# EAGLE schematic stm32f4_sd (EAGLE 6.3)
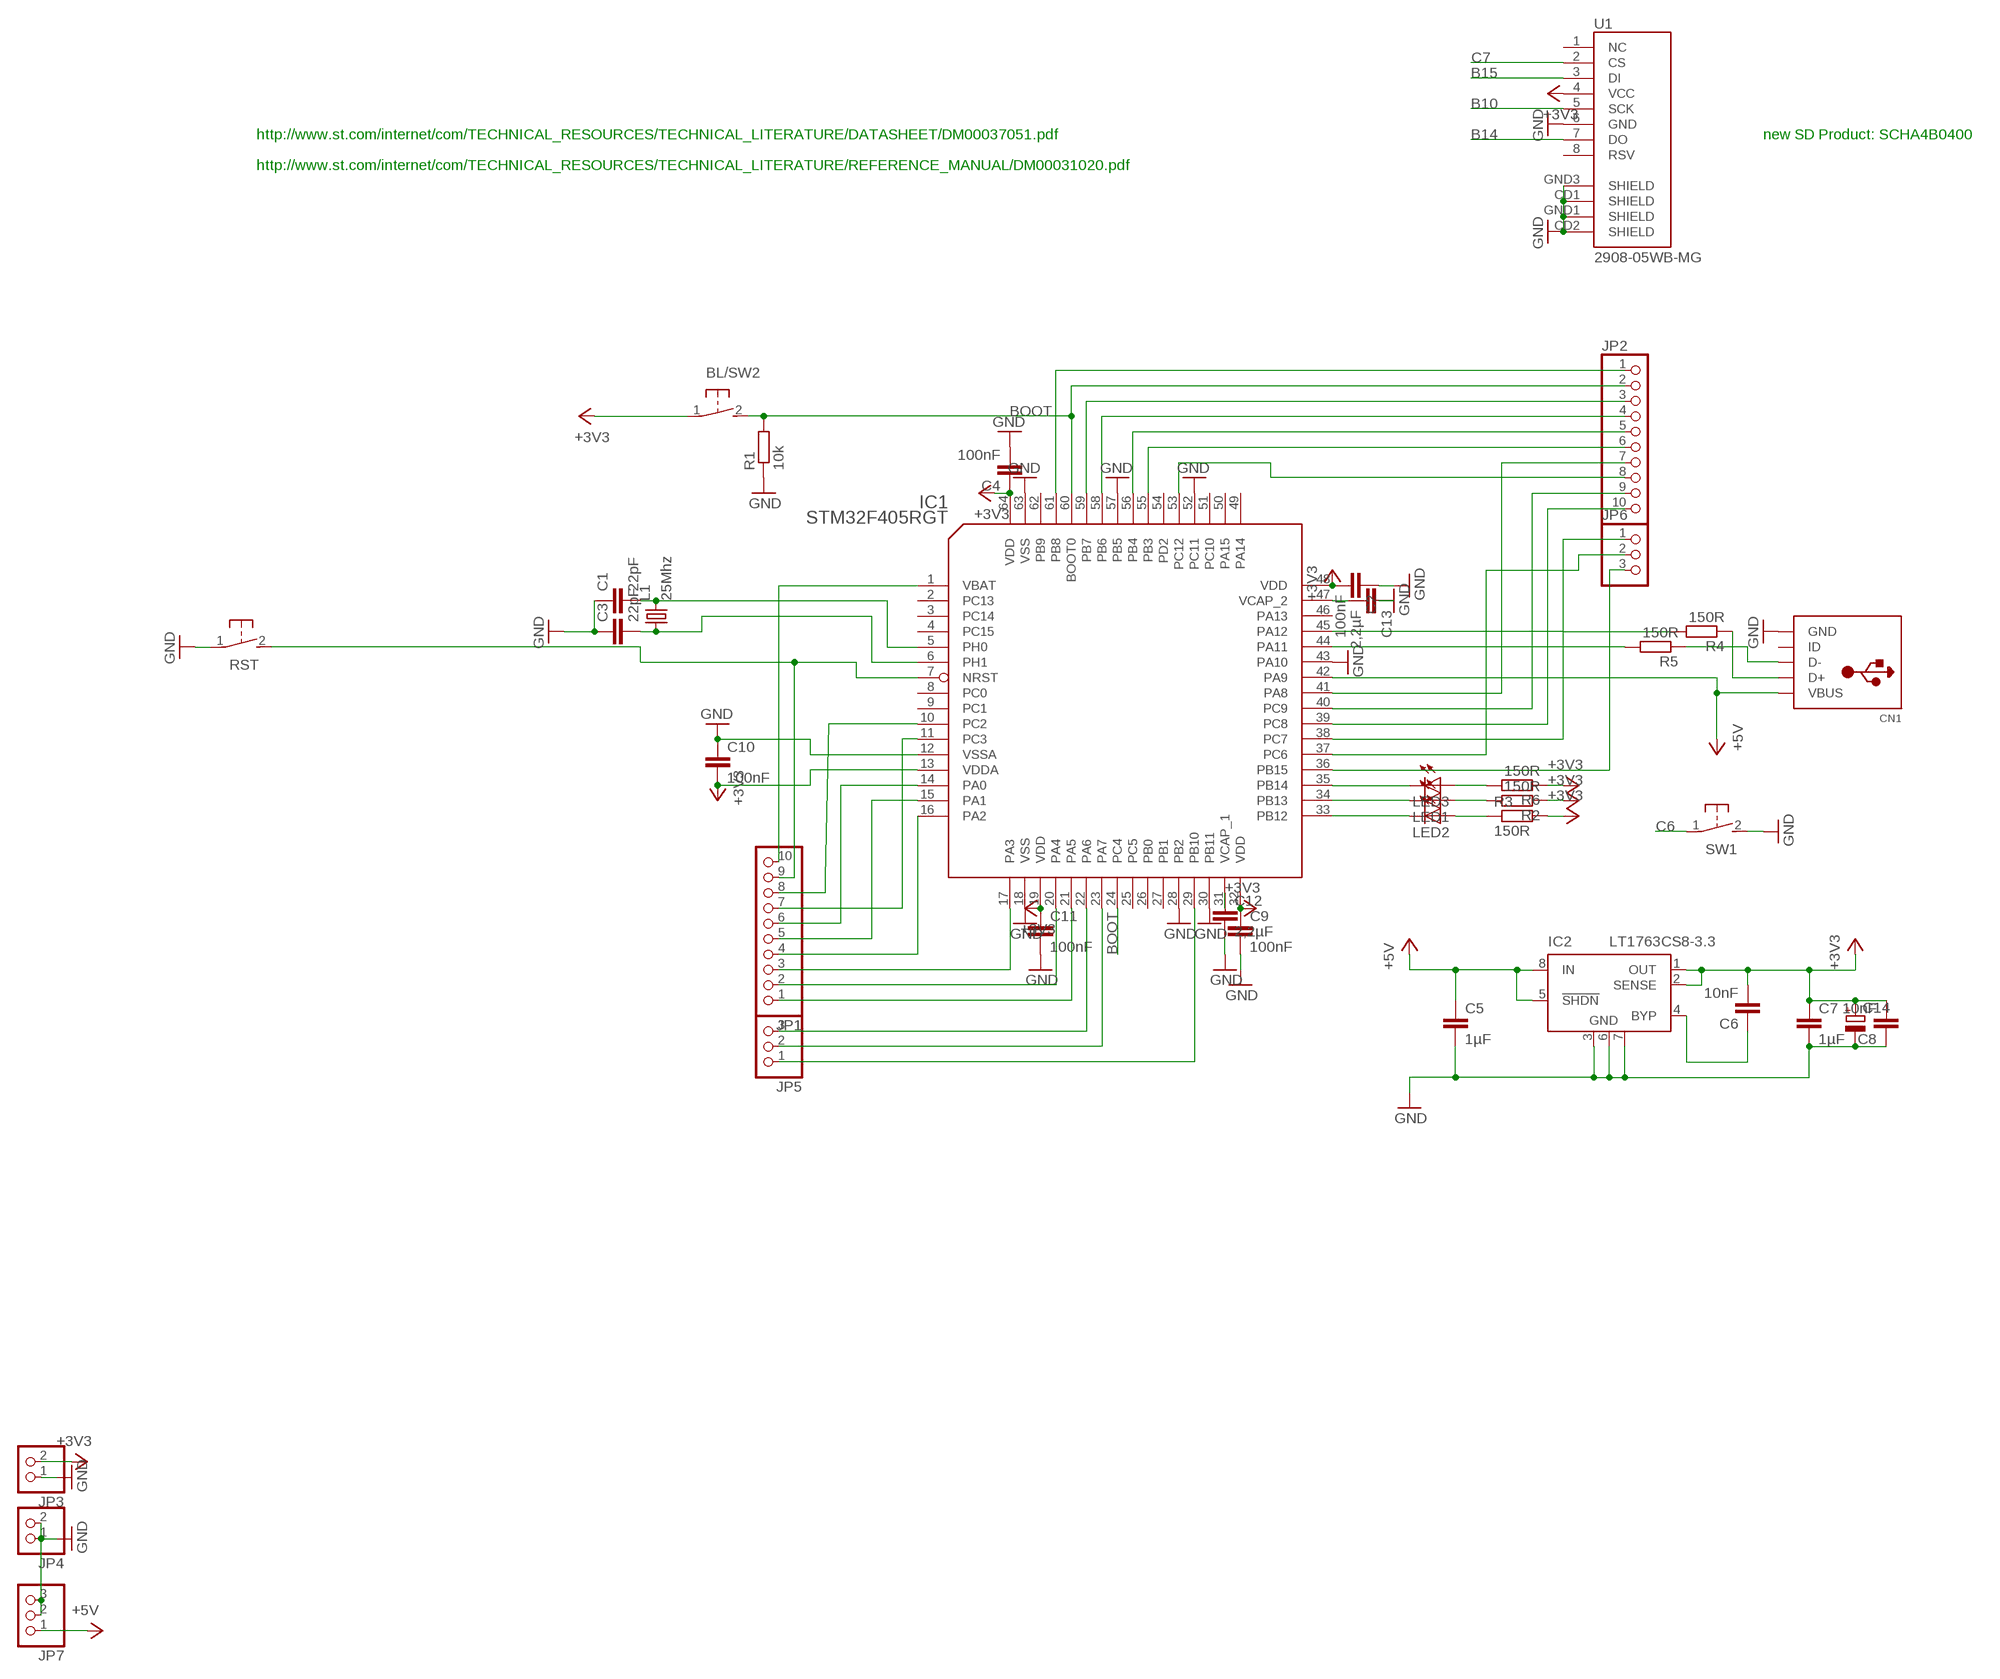
[diagram p0: schematic, sheet 1]

## Parts
BL/SW2  SWITCH_MCTAEF  [SWITCH_MCTAEF]
C1  22pF  C-EUC0402  [C0402]
C2  100nF  C-EUC0402  [C0402]
C3  22pF  C-EUC0402  [C0402]
C4  100nF  C-EUC0402  [C0402]
C5  1µF  CAP0805  [0805]
C6  10nF  C-EUC0402  [C0402]
C7  1µF  CAP0805  [0805]
C8  10nF  C-EUC0402  [C0402]
C9  100nF  C-EUC0402  [C0402]
C10  100nF  C-EUC0402  [C0402]
C11  100nF  C-EUC0402  [C0402]
C12  2,2µF  CAP0805  [0805]
C13  2,2µF  CAP0805  [0805]
C14  CPOL-EUSMCA  [SMC_A]
CN1  USBMINIB  [USB-MINIB]
IC1  STM32F405RGT  [LQFP64]
IC2  LT1763CS8-3.3  [SOIC8]
JP1  PINHD-1X10_2.54  [1X10]
JP2  PINHD-1X10_2.54  [1X10]
JP3  PINHD-1X02_2.54  [1X02]
JP4  PINHD-1X02_2.54  [1X02]
JP5  PINHD-1X03_2.54  [1X03]
JP6  PINHD-1X03_2.54  [1X03]
JP7  PINHD-1X03_2.54  [1X03]
L1  25Mhz  X22-OSCILLATOR  [X22]
LED1  LED0603  [LED-0603]
LED2  LED0603  [LED-0603]
LED3  LED0603  [LED-0603]
R1  10k  R-EU_R0402  [R0402]
R2  150R  R-EU_R0402  [R0402]
R3  150R  R-EU_R0402  [R0402]
R4  150R  R-EU_R0402  [R0402]
R5  150R  R-EU_R0402  [R0402]
R6  150R  R-EU_R0402  [R0402]
RST  SWITCH_MCTAEF  [SWITCH_MCTAEF]
SW1  SWITCH_MCTAEF  [SWITCH_MCTAEF]
U1  2908-05WB-MG  USD-SOCKETNEW  [MICRO-SD-SOCKET-PP]

## Nets
+3V3: BL/SW2.1 C2.2 C4.1 C6.2 C7.1 C8.2 C9.1 C10.2 C11.1 C14.+ IC1.13(VDDA) IC1.19(VDD) IC1.32(VDD) IC1.48(VDD) IC1.64(VDD) IC2.1(OUT) IC2.2(SENSE) JP3.2 R2.1 R3.2 R6.1 U1.4(VCC)
+5V: C5.1 CN1.VBUS IC1.42(PA9) IC2.5(!SHDN) IC2.8(IN) JP7.1
A0: IC1.14(PA0) JP1.6
A1: IC1.15(PA1) JP1.5
A3: IC1.17(PA3) JP1.3
A4: IC1.20(PA4) JP1.2
A5: IC1.21(PA5) JP1.1
A6: IC1.22(PA6) JP5.3
A7: IC1.23(PA7) JP5.2
A8: IC1.41(PA8) JP2.7
B4: IC1.56(PB4) JP2.5
B6: IC1.58(PB6) JP2.4
B7: IC1.59(PB7) JP2.3
B8: IC1.61(PB8) JP2.1
B10: IC1.29(PB10) JP5.1 U1.5(SCK)
B14: IC1.36(PB15) JP6.3 U1.7(DO)
B15: IC1.37(PC6) JP6.2 U1.3(DI)
BOOT: BL/SW2.2 IC1.24(PC4) IC1.60(BOOT0) JP2.2 R1.2
C2: IC1.10(PC2) JP1.8
C3: IC1.11(PC3) JP1.7
C6: IC1.38(PC7) JP6.1 SW1.1
C7: IC1.39(PC8) JP2.10 U1.2(CS)
C8: IC1.40(PC9) JP2.9
C12: IC1.53(PC12) JP2.8
GND: C1.1 C2.1 C3.1 C4.2 C5.2 C7.2 C8.1 C9.2 C10.1 C11.2 C12.2 C13.1 C14.- CN1.GND IC1.12(VSSA) IC1.18(VSS) IC1.28(PB2) IC1.30(PB11) IC1.43(PA10) IC1.52(PC11) IC1.57(PB5) IC1.63(VSS) IC2.3(GND) IC2.6(GND) IC2.7(GND) JP3.1 JP4.1 JP4.2 JP7.2 JP7.3 R1.1 RST.1 SW1.2 U1.6(GND) U1.CD1(SHIELD) U1.CD2(SHIELD) U1.GND1(SHIELD) U1.GND3(SHIELD)
N$1: IC1.35(PB14) LED3.C
N$2: IC1.16(PA2) JP1.4
N$3: C3.2 IC1.6(PH1) L1.1
N$4: C1.2 IC1.5(PH0) L1.3
N$5: IC1.7(NRST) JP1.9 RST.2
N$6: LED3.A R6.2
N$10: IC1.44(PA11) R5.2
N$12: C12.1 IC1.31(VCAP_1)
N$13: C6.1 IC2.4(BYP)
N$14: C13.2 IC1.47(VCAP_2)
N$15: IC1.33(PB12) LED2.C
N$18: LED1.A R2.2
N$22: LED2.A R3.1
N$26: IC1.34(PB13) LED1.C
N$32: IC1.45(PA12) R4.2
N$39: CN1.D+ R4.1
N$40: CN1.D- R5.1
PB3: IC1.55(PB3) JP2.6
VBAT: IC1.1(VBAT) JP1.10
Unconnected: CN1.ID IC1.2(PC13) IC1.3(PC14) IC1.4(PC15) IC1.8(PC0) IC1.9(PC1) IC1.25(PC5) IC1.26(PB0) IC1.27(PB1) IC1.46(PA13) IC1.49(PA14) IC1.50(PA15) IC1.51(PC10) IC1.54(PD2) IC1.62(PB9) U1.1(NC) U1.8(RSV)

## Notes on the sheet
- http://www.st.com/internet/com/TECHNICAL_RESOURCES/TECHNICAL_LITERATURE/DATASHEET/DM00037051.pdf | new SD Product: SCHA4B0400
- http://www.st.com/internet/com/TECHNICAL_RESOURCES/TECHNICAL_LITERATURE/REFERENCE_MANUAL/DM00031020.pdf

## Library data of the parts
BL/SW2 RST SW1 = seb:SWITCH_MCTAEF
C1-C4 C6 C8-C11 = rcl:C-EU: CAPACITOR, European symbol
C5 C7 C12 C13 = SparkFun:CAP: Capacitor Standard 0603 ceramic capacitor, and 0.1" leaded capacitor.
C14 = rcl:CPOL-EU: POLARIZED CAPACITOR, European symbol
CN1 = microbuilder:USB: USB Connectors USBMINIB - Surface Mount Female Mini-B USB Connector 4UConnector: 06564
IC1 = stm32:STM32F405R*T: STM32F405R*T ARM Cortex-M4 32b MCU+FPU, 210DMIPS, up to 1MB Flash/192+4KB RAM, USB OTG HS/FS, 17 TIMs, 3 ADCs, 15 comm.
IC2 = linear-technology:LT1763CS8: 500mA, Low Noise, LDO Micropower Regulators Source: http://cds.linear.com/docs/Datasheet/1763ff.pdf; MPN: LT1763CS8-3.3; OC_FARNELL: 1273617; OC_NEWARK: 57M6055
JP1 JP2 = pinhead-2:PINHD-1X10: PIN HEADER
JP3 JP4 = pinhead-2:PINHD-1X02: PIN HEADER
JP5-JP7 = pinhead-2:PINHD-1X03: PIN HEADER
L1 = seb:X22-OSCILLATOR
LED1-LED3 = SparkFun-LED:LED: LEDs Standard schematic elements and footprints for 5mm, 3mm, 1206, and 0603 sized LEDs. 5mm - Spark Fun Electronics SKU : COM-00529 (and others)
R1-R6 = rcl:R-EU_: RESISTOR, European symbol
U1 = SparkFun:USD-SOCKET: microSD Socket Push-push type uSD socket. Schematic element and footprint production proven. Spark Fun Electronics SKU : PRT-00127. tDoc lines correctly indicate media card edge positions when inserting (unlocked, locked, depressed).; 3M: 2908-05WB-MG